# Altium schematic sheet Sheet3_IR.SchDoc: Koruza Expander Board
size A4; Date: 12.7.2016; Author: Matej Gomboc; CompanyName: Institute IRNAS Rače; Revision: 1.0; SheetNumber: 3; SheetTotal: 4; CurrentDate: 12.7.2016
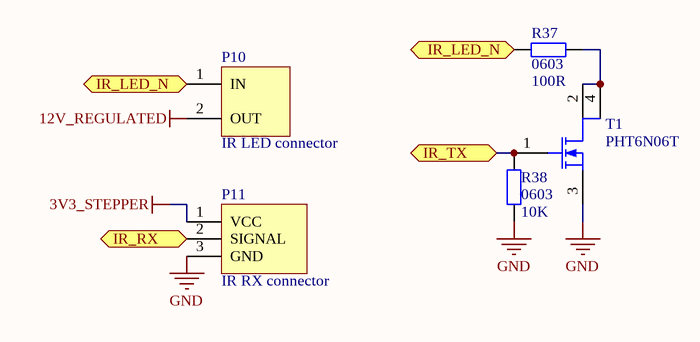
[diagram p0: Sheet3_IR.SchDoc]

## Parts
P10  IR LED connector  [term_block_2_45mm]
P11  IR RX connector  [term_block_3pole_2_45mm]
R37  0603  value 100R  [0603_HandSoldering]
R38  0603  value 10K  [0603_HandSoldering]
T1  PHT6N06T  [SOT230P700X180-4N]

## Ports
IR_LED_N, IR_RX, IR_TX

## Nets
3V3_STEPPER: P11.1(VCC)
12V_REGULATED: P10.2(OUT)
GND: P11.3(GND) R38.1 T1.3(S)
IR_LED_N: P10.1(IN) R37.2 ; port IR_LED_N
IR_RX: P11.2(SIGNAL) ; port IR_RX
IR_TX: R38.2 T1.1(G) ; port IR_TX
NetR37_1: R37.1 T1.2(D) T1.4(D)

## Library data of the parts
P10 = IR_LED_connector
P11 = IR_RX_connector
R37 R38 = resistor
T1 = PHT6N06T: N MOSFET